# Altium schematic sheet microphone.SchDoc
size A2
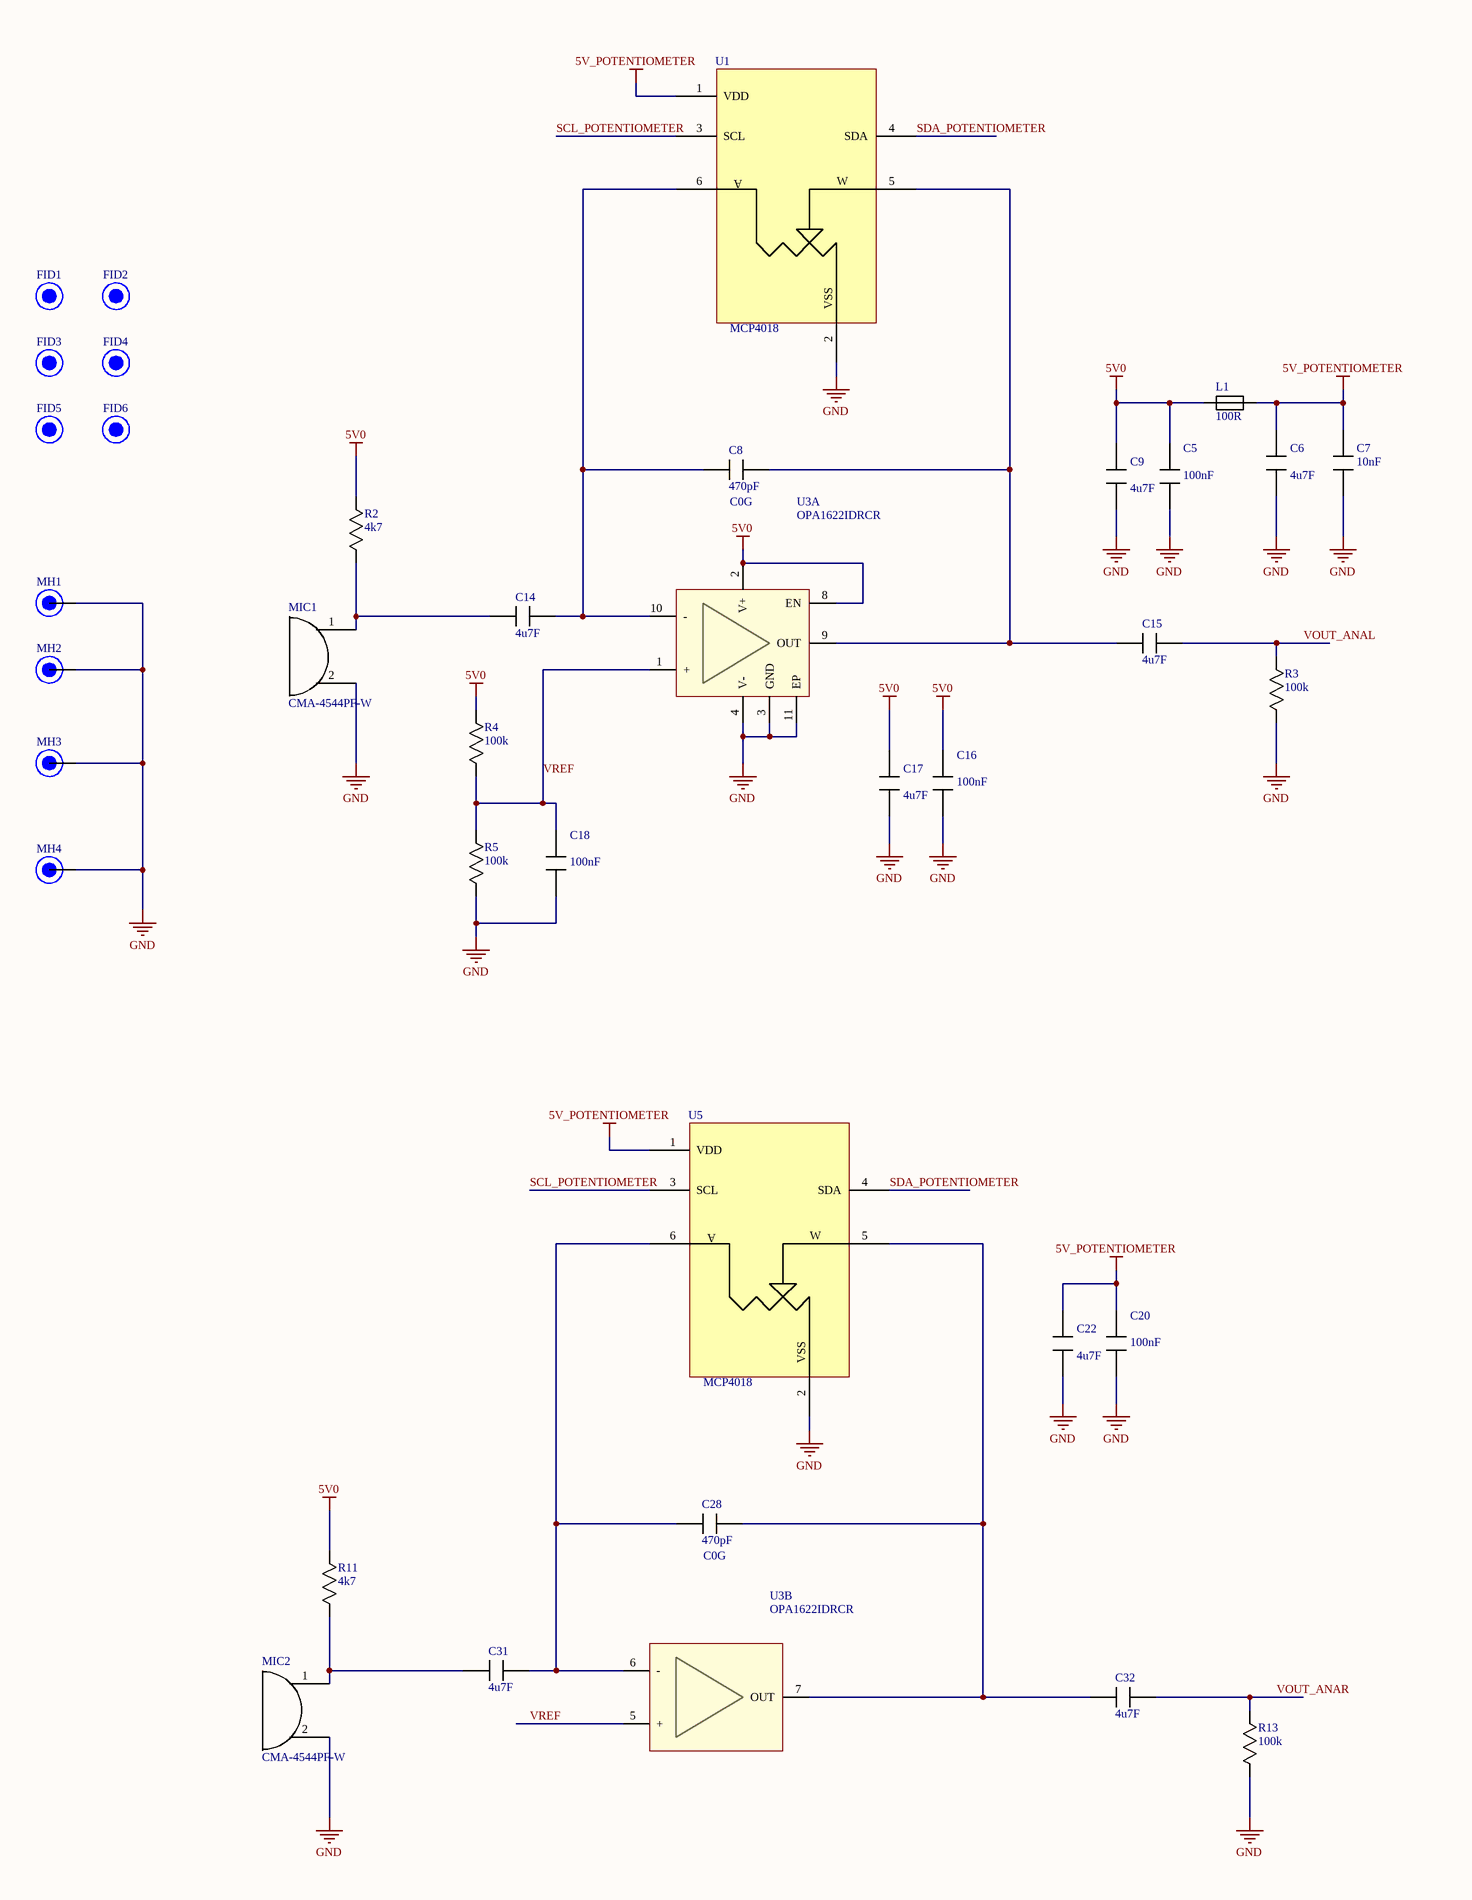
[diagram p0: microphone.SchDoc, left]
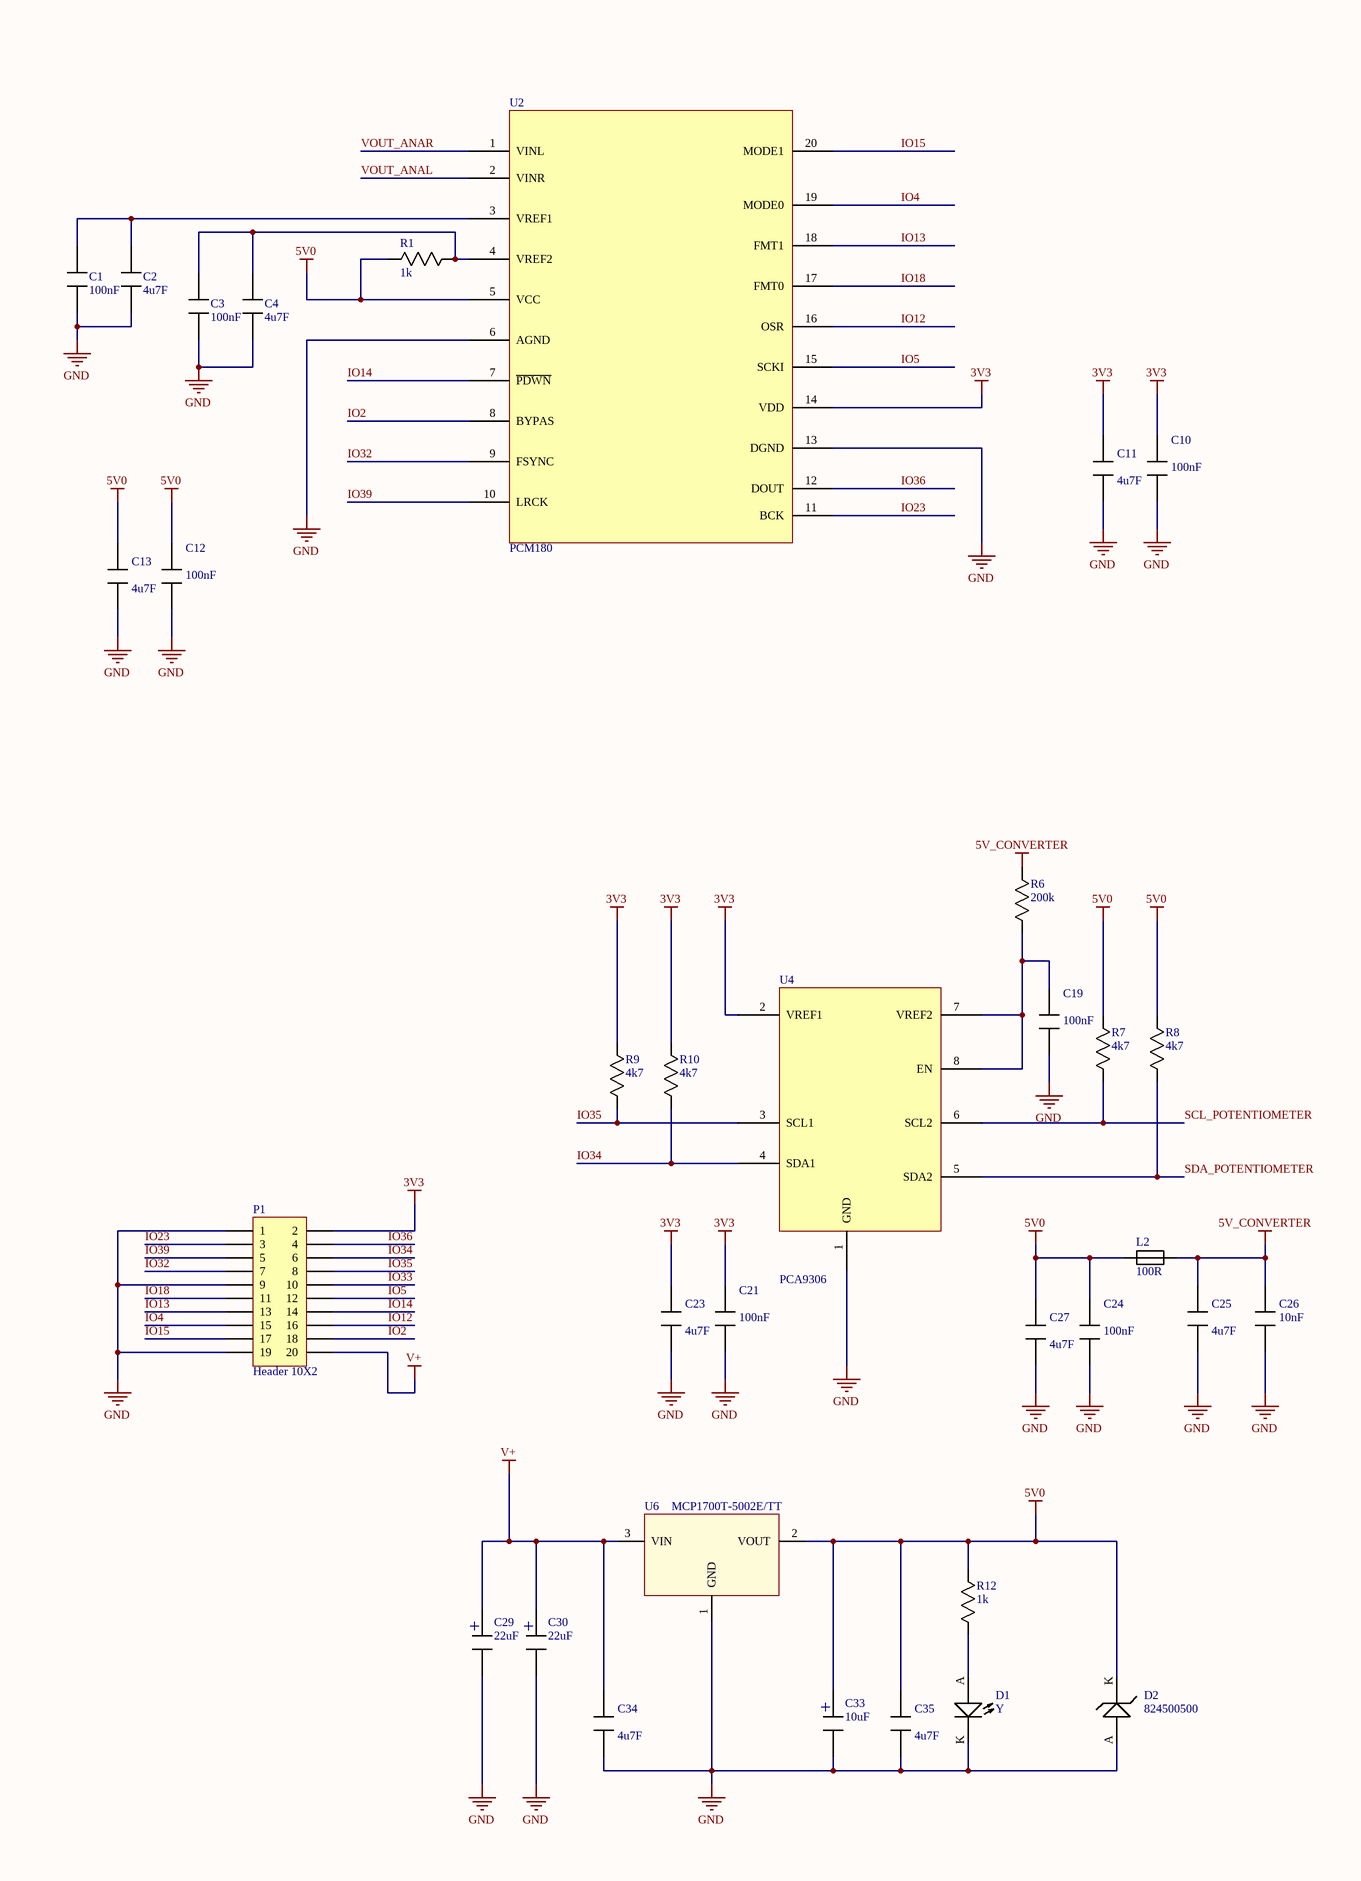
[diagram p1: microphone.SchDoc, right]

## Parts
C1  value 100nF  [0603]  (hidden comment: Capacitor)
C2  value 4u7F  [0805]  (hidden comment: Capacitor)
C3  value 100nF  [0603]  (hidden comment: Capacitor)
C4  value 4u7F  [0805]  (hidden comment: Capacitor)
C5  value 100nF  [0603]  (hidden comment: Capacitor)
C6  value 4u7F  [0805]  (hidden comment: Capacitor)
C7  value 10nF  [0603]  (hidden comment: Capacitor)
C8  value 470pF  Type: C0G  [0603]  (hidden comment: Capacitor)
C9  value 4u7F  [0805]  (hidden comment: Capacitor)
C10  value 100nF  [0603]  (hidden comment: Capacitor)
C11  value 4u7F  [0805]  (hidden comment: Capacitor)
C12  value 100nF  [0603]  (hidden comment: Capacitor)
C13  value 4u7F  [0805]  (hidden comment: Capacitor)
C14  value 4u7F  [0805]  (hidden comment: Capacitor)
C15  value 4u7F  [0805]  (hidden comment: Capacitor)
C16  value 100nF  [0603]  (hidden comment: Capacitor)
C17  value 4u7F  [0805]  (hidden comment: Capacitor)
C18  value 100nF  [0603]  (hidden comment: Capacitor)
C19  value 100nF  [0603]  (hidden comment: Capacitor)
C20  value 100nF  [0603]  (hidden comment: Capacitor)
C21  value 100nF  [0603]  (hidden comment: Capacitor)
C22  value 4u7F  [0805]  (hidden comment: Capacitor)
C23  value 4u7F  [0805]  (hidden comment: Capacitor)
C24  value 100nF  [0603]  (hidden comment: Capacitor)
C25  value 4u7F  [0805]  (hidden comment: Capacitor)
C26  value 10nF  [0603]  (hidden comment: Capacitor)
C27  value 4u7F  [0805]  (hidden comment: Capacitor)
C28  value 470pF  Type: C0G  [0603]  (hidden comment: Capacitor)
C29  value 22uF  [CAP_RAD_SMD_DIA157]  (hidden comment: Capacitor_Polarized)
C30  value 22uF  [CAP_RAD_SMD_DIA157]  (hidden comment: Capacitor_Polarized)
C31  value 4u7F  [0805]  (hidden comment: Capacitor)
C32  value 4u7F  [0805]  (hidden comment: Capacitor)
C33  value 10uF  [CAP_RAD_SMD_DIA157]  (hidden comment: Capacitor_Polarized)
C34  value 4u7F  [0805]  (hidden comment: Capacitor)
C35  value 4u7F  [0805]  (hidden comment: Capacitor)
D1  Type: Y  [0805_LED]  (hidden comment: Diode_LED)
D2  Mfg_PN: 824500500  [DIODE_DO-214AC/SMA]  (hidden comment: Diode_zener)
FID1  Fiducial 1mm  [FID_1MM]  (value not drawn)  (no BOM)
FID2  Fiducial 1mm  [FID_1MM]  (value not drawn)  (no BOM)
FID3  Fiducial 1mm  [FID_1MM]  (value not drawn)  (no BOM)
FID4  Fiducial 1mm  [FID_1MM]  (value not drawn)  (no BOM)
FID5  Fiducial 1mm  [FID_1MM]  (value not drawn)  (no BOM)
FID6  Fiducial 1mm  [FID_1MM]  (value not drawn)  (no BOM)
L1  value 100R  [0603]  (hidden comment: Ferrite)
L2  value 100R  [0603]  (hidden comment: Ferrite)
MH1  Mounting Hole 6-32  [MH_ENG_6-32]  (value not drawn)  (no BOM)
MH2  Mounting Hole 6-32  [MH_ENG_6-32]  (value not drawn)  (no BOM)
MH3  Mounting Hole 6-32  [MH_ENG_6-32]  (value not drawn)  (no BOM)
MH4  Mounting Hole 6-32  [MH_ENG_6-32]  (value not drawn)  (no BOM)
MIC1  CMA-4544PF-W  [MIC]
MIC2  CMA-4544PF-W  [MIC]
P1  Header 10X2  [HDR2X10]
R1  value 1k  [0603]  (hidden comment: Resistor)
R2  value 4k7  [0603]  (hidden comment: Resistor)
R3  value 100k  [0603]  (hidden comment: Resistor)
R4  value 100k  [0603]  (hidden comment: Resistor)
R5  value 100k  [0603]  (hidden comment: Resistor)
R6  value 200k  [0603]  (hidden comment: Resistor)
R7  value 4k7  [0603]  (hidden comment: Resistor)
R8  value 4k7  [0603]  (hidden comment: Resistor)
R9  value 4k7  [0603]  (hidden comment: Resistor)
R10  value 4k7  [0603]  (hidden comment: Resistor)
R11  value 4k7  [0603]  (hidden comment: Resistor)
R12  value 1k  [0603]  (hidden comment: Resistor)
R13  value 100k  [0603]  (hidden comment: Resistor)
U1  MCP4018  [6-TSSOP]
U2  PCM180  [20-SSOP]
U3  Mfg_PN: OPA1622IDRCR  [10-VFDFN]  (hidden comment: OPA1622)  (parts A,B of 2)
U4  PCA9306  [8-XFDFN]
U5  MCP4018  [6-TSSOP]
U6  Mfg_PN: MCP1700T-5002E/TT  [SOT23_132]  (hidden comment: MCP1700)

## Nets
3V3: C10.1 C11.1 C21.1 C23.1 P1.2 R9.1 R10.1 U2.14(VDD) U4.2(VREF1)
5V0: C5.1 C9.1 C12.1 C13.1 C16.1 C17.1 C24.1 C27.1 C33.+ C35.1 D2.K L1.1 L2.1 R1.2 R2.1 R4.2 R7.1 R8.1 R11.1 R12.2 U2.5(VCC) U3.2(V+) U3.8(EN) U6.2(VOUT)
5V_CONVERTER: C25.1 C26.1 L2.2 R6.1
5V_POTENTIOMETER: C6.1 C7.1 C20.1 C22.1 L1.2 U1.1(VDD) U5.1(VDD)
GND: C1.1 C2.1 C3.1 C4.1 C5.2 C6.2 C7.2 C9.2 C10.2 C11.2 C12.2 C13.2 C16.2 C17.2 C18.2 C19.2 C20.2 C21.2 C22.2 C23.2 C24.2 C25.2 C26.2 C27.2 C29.- C30.- C33.- C34.2 C35.2 D1.K D2.A MH1.1 MH2.1 MH3.1 MH4.1 MIC1.2 MIC2.2 P1.1 P1.9 P1.19 R3.1 R5.1 R13.1 U1.2(VSS) U2.6(AGND) U2.13(DGND) U3.3(GND) U3.4(V-) U3.11(EP) U4.1(GND) U5.2(VSS) U6.1(GND)
V+: C29.+ C30.+ C34.1 P1.20 U6.3(VIN)
IO2: P1.18 U2.8(BYPAS)
IO4: P1.15 U2.19(MODE0)
IO5: P1.12 U2.15(SCKI)
IO12: P1.16 U2.16(OSR)
IO13: P1.13 U2.18(FMT1)
IO14: P1.14 U2.7(~{PDWN})
IO15: P1.17 U2.20(MODE1)
IO18: P1.11 U2.17(FMT0)
IO23: P1.3 U2.11(BCK)
IO32: P1.7 U2.9(FSYNC)
IO33: P1.10
IO34: P1.6 R10.2 U4.4(SDA1)
IO35: P1.8 R9.2 U4.3(SCL1)
IO36: P1.4 U2.12(DOUT)
IO39: P1.5 U2.10(LRCK)
SCL_POTENTIOMETER: R7.2 U1.3(SCL) U4.6(SCL2) U5.3(SCL)
SDA_POTENTIOMETER: R8.2 U1.4(SDA) U4.5(SDA2) U5.4(SDA)
VOUT_ANAL: C15.2 R3.2 U2.2(VINR)
VOUT_ANAR: C32.2 R13.2 U2.1(VINL)
VREF: C18.1 R4.1 R5.2 U3.1(+) U3.5(+)
NetC1_2: C1.2 C2.2 U2.3(VREF1)
NetC3_2: C3.2 C4.2 R1.1 U2.4(VREF2)
NetC8_1: C8.1 C14.2 U1.6(A) U3.10(-)
NetC8_2: C8.2 C15.1 U1.5(W) U3.9(OUT)
NetC14_1: C14.1 MIC1.1 R2.2
NetC19_1: C19.1 R6.2 U4.7(VREF2) U4.8(EN)
NetC28_1: C28.1 C31.2 U3.6(-) U5.6(A)
NetC28_2: C28.2 C32.1 U3.7(OUT) U5.5(W)
NetC31_1: C31.1 MIC2.1 R11.2
NetD1_A: D1.A R12.1

## Library data of the parts
C1 C3 C5 C10 C12 C16 C18-C21 C24 = Capacitor: Mfg: Samsung; Mfg_PN: CL10F104ZO8NNNC; HelpURL: *; NI: *; Supplier1: Digikey; Supplier1_PN: 1276-1258-1-ND; Tolerance: *; Type: *; Rating: *
C2 C4 C6 C9 C11 C13-C15 C17 C22 C23 C25 C27 C31 C32 C34 C35 = Capacitor: Mfg: Samsung; Mfg_PN: CL21A475KAQNNNG; HelpURL: *; NI: *; Supplier1: Digikey; Supplier1_PN: 1276-6462-1-ND; Tolerance: *; Type: *; Rating: *
C7 C26 = Capacitor: Mfg: Murata; Mfg_PN: CL05B103KO5NNNC; HelpURL: *; NI: *; Supplier1: Digikey; Supplier1_PN: 1276-1051-1-ND; Tolerance: *; Type: *; Rating: *
C8 C28 = Capacitor: Mfg: Samsung; Mfg_PN: CL10C471JB8NCNC; HelpURL: *; NI: *; Supplier1: Digikey; Supplier1_PN: 1276-2302-1-ND; Tolerance: *; Rating: *
C29 = Capacitor_Polarized: Capacitor; Mfg: Panasonic; Mfg_PN: Part Number EEE-FT1V220AR; HelpURL: *; NI: *; Supplier1: Digikey; Supplier1_PN: PCE5012CT-ND; Tolerance: *; Type: *; Rating: *
C30 = Capacitor_Polarized: Capacitor; Mfg: Panasonic; Mfg_PN: EEE-FT1V220AR; HelpURL: *; NI: *; Supplier1: Digikey; Supplier1_PN: PCE5012CT-ND; Tolerance: *; Type: *; Rating: *
C33 = Capacitor_Polarized: Capacitor; Mfg: Nichicon; Mfg_PN: UWX1C100MCL1GB; HelpURL: *; NI: *; Supplier1: Digikey; Supplier1_PN: 493-2100-1-ND; Tolerance: *; Type: *; Rating: *
D1 = Diode_LED: LED; Mfg: Osram; Mfg_PN: LY R976-PS-36; HelpURL: *; NI: *; Supplier1: Digikey; Supplier1_PN: 475-2560-1-ND; Tolerance: *; Rating: *; Value: *
D2 = Diode_zener: Diode; Mfg: Wurth; HelpURL: *; NI: *; Supplier1: Digikey; Supplier1_PN: 732-9974-1-ND; Tolerance: *; Type: *; Rating: *; Value: *
FID1-FID6 = FID_1MM: FID - 1MM; Current: *; Mfg Part Number: *; HelpURL: *; CreatedBy: Jonathan Bouchard; VerifiedBy: Alexandre Imbeault; FootprintNameOK: Jonathan Bouchard; Temperature: *; Power: *; Precision: *; Value: *; Mfg: *; Package: *; Voltage: *
L1 L2 = Ferrite: Mfg: Bourns; Mfg_PN: MH2029-101Y; Rating: 1A; HelpURL: *; NI: *; Supplier1: Digikey; Supplier1_PN: MH2029-101YCT-ND; Tolerance: *; Type: *
MH1-MH4 = MH_6-32: MH - Mounting Hole 6-32; Current: *; Mfg Part Number: *; HelpURL: *; CreatedBy: Jonathan Bouchard; VerifiedBy: Alexandre Imbeault; FootprintNameOK: Jonathan Bouchard; Temperature: *; Power: *; Precision: *; Value: *; Mfg: *; Package: *; Voltage: *
MIC1 MIC2 = CMA-4544PF-W: Mfg: CUI Inc.; CreatedBy: Emile Laplante; HelpURL: https://www.digikey.ca/product-detail/en/cui-inc/CMA-4544PF-W/102-1721-ND/1869981; Mfg Part Number: CMA-4544PF-W; NI: *; Package: *; Power: *; Supplier: Digi-Key; Supplier Part Numer: 102-1721-ND; Temperature: *; Value: *; VerifiedBy: *; Voltage: *
P1 = Header 10X2: Header, 10-Pin, Dual row; LatestRevisionDate: 17-Jul-2002; LatestRevisionNote: Re-released for DXP Platform.; Publisher: Altium Limited
R1 R12 = Resistor: Mfg: Yageo; Mfg_PN: RC0603JR-071KL; HelpURL: *; NI: *; Supplier1: Digikey; Supplier1_PN: 311-1.0KGRCT-ND; Type: *; Rating: *; Tolerance: *
R2 R7-R11 = Resistor: Mfg: Yageo; Mfg_PN: RC0603JR-074K7L; HelpURL: *; NI: *; Supplier1: Digikey; Supplier1_PN: 311-4.7KGRCT-ND; Type: *; Rating: *; Tolerance: *
R3-R5 R13 = Resistor: Mfg: Yageo; Mfg_PN: 311-10GRCT-ND; HelpURL: *; NI: *; Supplier1: Digikey; Supplier1_PN: 311-100KGRCT-ND; Type: *; Rating: *; Tolerance: *
R6 = Resistor: Mfg: Panasonic Electronic Components; Mfg_PN: ERA-3AEB204V; HelpURL: *; NI: *; Supplier1: Digikey; Supplier1_PN: P200KDBCT-ND; Type: *; Rating: *; Tolerance: *
U1 U5 = MCP4018: Mfg Part Number: MCP4018T-503E/LT; Mfg: Microchip Technology; CreatedBy: Emile Laplante; HelpURL: https://www.digikey.ca/product-detail/en/microchip-technology/MCP4018T-503E-LT/MCP4018T-503E-LTCT-ND/2060154; NI: *; Power: *; Supplier: digikey; Supplier Part Numer: MCP4018T-503E/LTCT-ND; Temperature: *; Value: *; VerifiedBy: *; Voltage: *
U2 = PCM180: Mfg Part Number: PCM1802DBR; Mfg: Texas Instruments; CreatedBy: Emile Laplante; HelpURL: https://www.digikey.ca/product-detail/en/texas-instruments/PCM1802DBR/296-26304-1-ND/2254955; NI: *; Power: *; Supplier: digikey; Supplier Part Numer: 296-26304-1-ND; Temperature: *; Value: *; VerifiedBy: *; Voltage: *
U3 = OPA1622: Dual amplifier (headphone driver); Mfg: Texas Instruments; HelpURL: *; NI: *; Rating: *; Supplier1: Digikey; Supplier1_PN: 296-45038-1-ND; Tolerance: *; Value: *
U4 = PCA9306: Mfg Part Number: PCA9306DQER; Mfg: Txas Instruments; CreatedBy: Emile Laplante; HelpURL: https://www.digikey.ca/product-detail/en/texas-instruments/PCA9306DQER/296-27957-1-ND/2446266; NI: *; Power: *; Supplier: digikey; Supplier Part Numer: 296-27957-1-ND; Temperature: *; Value: *; VerifiedBy: *; Voltage: *
U6 = MCP1700: Linear voltage regulator; Mfg: Microchip; HelpURL: http://ww1.microchip.com/downloads/en/DeviceDoc/20001826C.pdf; NI: *; Supplier1: Digikey; Supplier1_PN: MCP1700T5002ETTCT-ND; Type: *